# EAGLE design LED_BOARD_1st_Iteration (EAGLE 9.6.2)
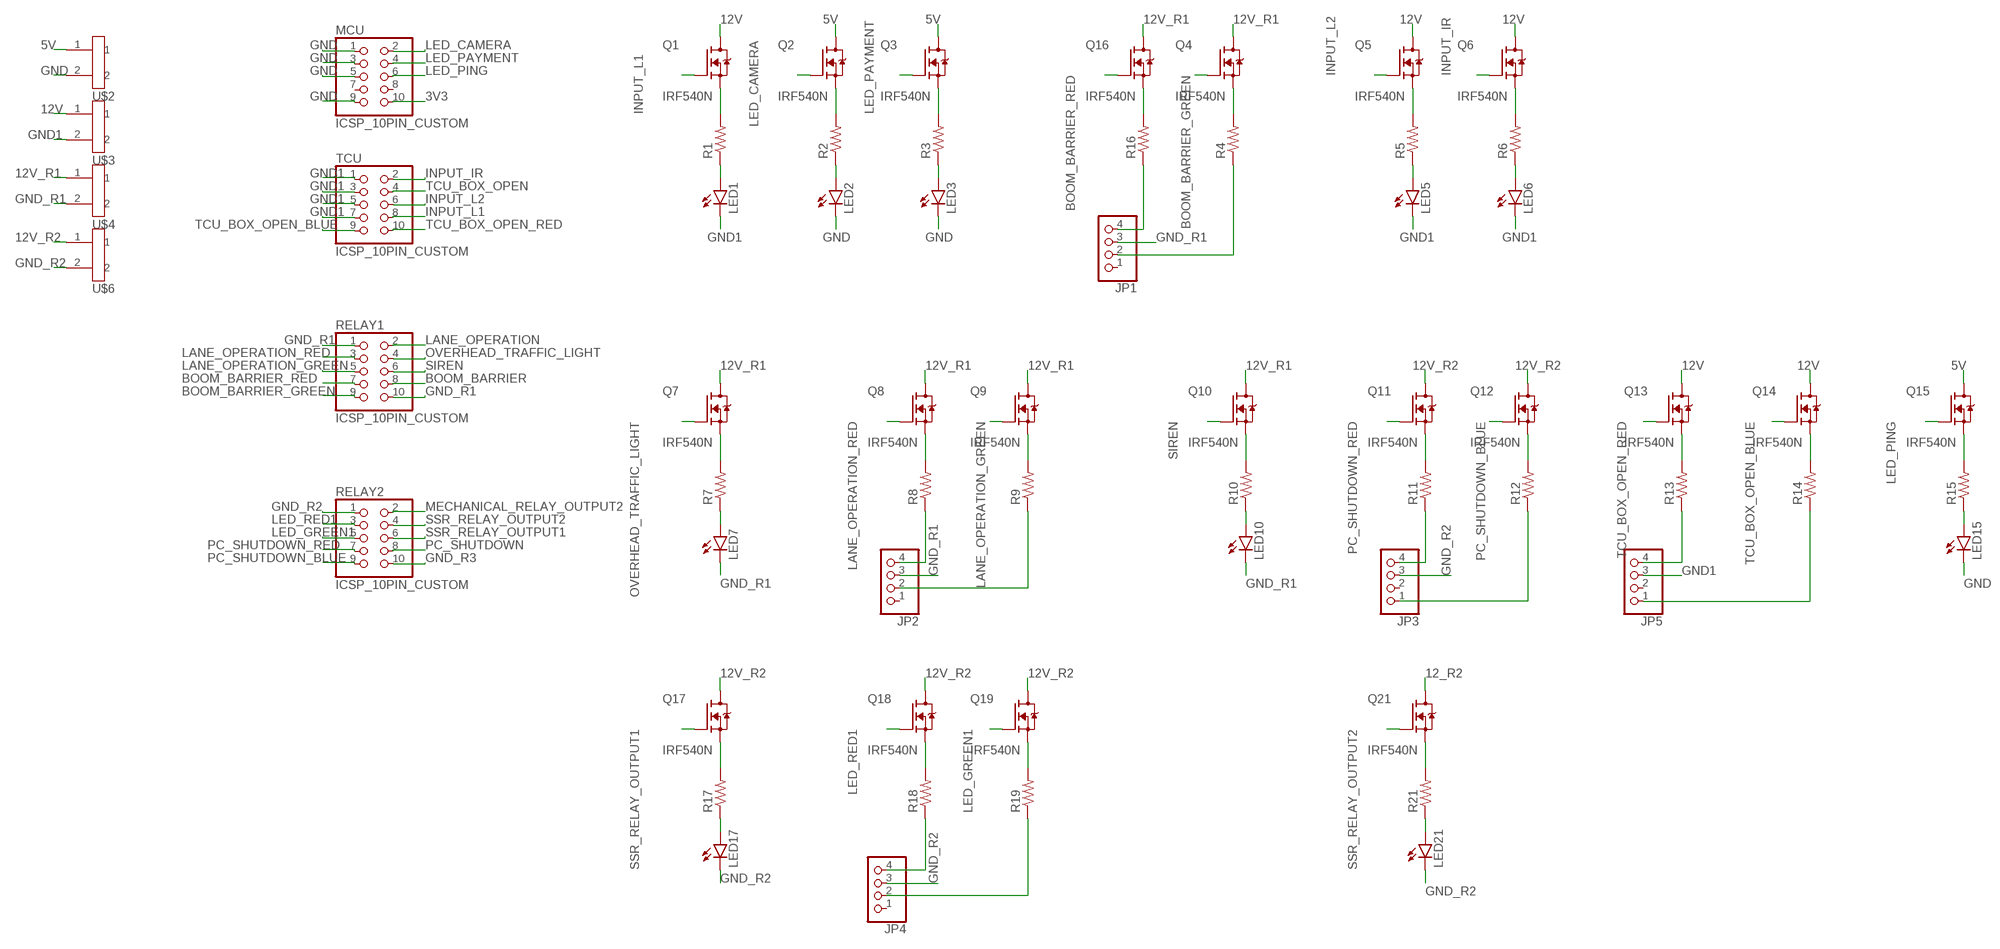
[diagram p0: schematic, sheet 1]

## Parts
JP1  PINHD-1X4  [1X04]
JP2  PINHD-1X4  [1X04]
JP3  PINHD-1X4  [1X04]
JP4  PINHD-1X4  [1X04]
JP5  PINHD-1X4  [1X04]
LED1  LED  [LED]
LED2  LED  [LED]
LED3  LED  [LED]
LED5  LED  [LED]
LED6  LED  [LED]
LED7  LED  [LED]
LED10  LED  [LED]
LED15  LED  [LED]
LED17  LED  [LED]
LED21  LED  [LED]
MCU  ICSP_10PIN_CUSTOM  [ICSP_10PIN_CUSTOM]
Q1  IRF540N  [TO254P1054X469X1930-3]
Q2  IRF540N  [TO254P1054X469X1930-3]
Q3  IRF540N  [TO254P1054X469X1930-3]
Q4  IRF540N  [TO254P1054X469X1930-3]
Q5  IRF540N  [TO254P1054X469X1930-3]
Q6  IRF540N  [TO254P1054X469X1930-3]
Q7  IRF540N  [TO254P1054X469X1930-3]
Q8  IRF540N  [TO254P1054X469X1930-3]
Q9  IRF540N  [TO254P1054X469X1930-3]
Q10  IRF540N  [TO254P1054X469X1930-3]
Q11  IRF540N  [TO254P1054X469X1930-3]
Q12  IRF540N  [TO254P1054X469X1930-3]
Q13  IRF540N  [TO254P1054X469X1930-3]
Q14  IRF540N  [TO254P1054X469X1930-3]
Q15  IRF540N  [TO254P1054X469X1930-3]
Q16  IRF540N  [TO254P1054X469X1930-3]
Q17  IRF540N  [TO254P1054X469X1930-3]
Q18  IRF540N  [TO254P1054X469X1930-3]
Q19  IRF540N  [TO254P1054X469X1930-3]
Q21  IRF540N  [TO254P1054X469X1930-3]
R1  RESISTOR  [RESISTOR]
R2  RESISTOR  [RESISTOR]
R3  RESISTOR  [RESISTOR]
R4  RESISTOR  [RESISTOR]
R5  RESISTOR  [RESISTOR]
R6  RESISTOR  [RESISTOR]
R7  RESISTOR  [RESISTOR]
R8  RESISTOR  [RESISTOR]
R9  RESISTOR  [RESISTOR]
R10  RESISTOR  [RESISTOR]
R11  RESISTOR  [RESISTOR]
R12  RESISTOR  [RESISTOR]
R13  RESISTOR  [RESISTOR]
R14  RESISTOR  [RESISTOR]
R15  RESISTOR  [RESISTOR]
R16  RESISTOR  [RESISTOR]
R17  RESISTOR  [RESISTOR]
R18  RESISTOR  [RESISTOR]
R19  RESISTOR  [RESISTOR]
R21  RESISTOR  [RESISTOR]
RELAY1  ICSP_10PIN_CUSTOM  [ICSP_10PIN_CUSTOM]
RELAY2  ICSP_10PIN_CUSTOM  [ICSP_10PIN_CUSTOM]
TCU  ICSP_10PIN_CUSTOM  [ICSP_10PIN_CUSTOM]
U$2  GREEN_PLUG_90_2  [GREEN_PLUG_90_2]
U$3  GREEN_PLUG_90_2  [GREEN_PLUG_90_2]
U$4  GREEN_PLUG_90_2  [GREEN_PLUG_90_2]
U$6  GREEN_PLUG_90_2  [GREEN_PLUG_90_2]

## Nets
3V3: MCU.10
5V: Q2.2(D) Q3.2(D) Q15.2(D) U$2.1
12_R2: Q21.2(D)
12V: Q1.2(D) Q5.2(D) Q6.2(D) Q13.2(D) Q14.2(D) U$3.1
12V_R1: Q4.2(D) Q7.2(D) Q8.2(D) Q9.2(D) Q10.2(D) Q16.2(D) U$4.1
12V_R2: Q11.2(D) Q12.2(D) Q17.2(D) Q18.2(D) Q19.2(D) U$6.1
BOOM_BARRIER: RELAY1.8
BOOM_BARRIER_GREEN: Q4.1(G) RELAY1.9
BOOM_BARRIER_RED: Q16.1(G) RELAY1.7
GND: LED2.K(C) LED3.K(C) LED15.K(C) MCU.1 MCU.3 MCU.5 MCU.9 U$2.2
GND1: JP5.3 LED1.K(C) LED5.K(C) LED6.K(C) TCU.1 TCU.3 TCU.5 TCU.7 U$3.2
GND_R1: JP1.3 JP2.3 LED7.K(C) LED10.K(C) RELAY1.1 RELAY1.10 U$4.2
GND_R2: JP3.3 JP4.3 LED17.K(C) LED21.K(C) RELAY2.1 U$6.2
GND_R3: RELAY2.10
INPUT_IR: Q6.1(G) TCU.2
INPUT_L1: Q1.1(G) TCU.8
INPUT_L2: Q5.1(G) TCU.6
LANE_OPERATION: RELAY1.2
LANE_OPERATION_GREEN: Q9.1(G) RELAY1.5
LANE_OPERATION_RED: Q8.1(G) RELAY1.3
LED_CAMERA: MCU.2 Q2.1(G)
LED_GREEN1: Q19.1(G) RELAY2.5
LED_PAYMENT: MCU.4 Q3.1(G)
LED_PING: MCU.6 Q15.1(G)
LED_RED1: Q18.1(G) RELAY2.3
MECHANICAL_RELAY_OUTPUT2: RELAY2.2
N$1: Q1.3(S) R1.2
N$2: LED1.A R1.1
N$3: JP1.4 R16.1
N$4: JP1.2 R4.1
N$5: JP2.4 R8.1
N$6: Q2.3(S) R2.2
N$7: LED2.A R2.1
N$8: JP2.2 R9.1
N$9: JP5.4 R13.1
N$10: JP3.4 R11.1
N$11: Q3.3(S) R3.2
N$12: LED3.A R3.1
N$13: JP3.1 R12.1
N$14: JP5.1 R14.1
N$16: Q4.3(S) R4.2
N$21: Q5.3(S) R5.2
N$22: LED5.A R5.1
N$26: Q6.3(S) R6.2
N$27: LED6.A R6.1
N$31: Q7.3(S) R7.2
N$32: LED7.A R7.1
N$36: Q8.3(S) R8.2
N$41: Q9.3(S) R9.2
N$46: Q10.3(S) R10.2
N$47: LED10.A R10.1
N$51: Q11.3(S) R11.2
N$56: Q12.3(S) R12.2
N$61: Q13.3(S) R13.2
N$66: Q14.3(S) R14.2
N$71: Q15.3(S) R15.2
N$72: LED15.A R15.1
N$76: Q16.3(S) R16.2
N$81: Q17.3(S) R17.2
N$82: LED17.A R17.1
N$86: Q18.3(S) R18.2
N$87: JP4.4 R18.1
N$91: Q19.3(S) R19.2
N$92: JP4.2 R19.1
N$101: Q21.3(S) R21.2
N$102: LED21.A R21.1
OVERHEAD_TRAFFIC_LIGHT: Q7.1(G) RELAY1.4
PC_SHUTDOWN: RELAY2.8
PC_SHUTDOWN_BLUE: Q12.1(G) RELAY2.9
PC_SHUTDOWN_RED: Q11.1(G) RELAY2.7
SIREN: Q10.1(G) RELAY1.6
SSR_RELAY_OUTPUT1: Q17.1(G) RELAY2.6
SSR_RELAY_OUTPUT2: Q21.1(G) RELAY2.4
TCU_BOX_OPEN: TCU.4
TCU_BOX_OPEN_BLUE: Q14.1(G) TCU.9
TCU_BOX_OPEN_RED: Q13.1(G) TCU.10
Unconnected: JP1.1 JP2.1 JP3.2 JP4.1 JP5.2 MCU.7 MCU.8

## Library data of the parts
JP1-JP5 = pinhead:PINHD-1X4: PIN HEADER
LED1-LED3 LED5-LED7 LED10 LED15 LED17 LED21 = Hand_Solder:LED: LED HAND SOLDER
MCU RELAY1 RELAY2 TCU = ISCP_10PIN_CUSTOM:ICSP_10PIN_CUSTOM
Q1-Q19 Q21 = IRF540N:IRF540N: Check availability <https://pricing.snapeda.com/parts/IRF540N/Infineon%20Technologies/view-part?ref=eda>; AVAILABILITY: In Stock; CHECK_PRICES: https://www.snapeda.com/parts/IRF540N/Infineon/view-part/?ref=eda; DESCRIPTION: Transistor NPN MOS IRF540/IRF540N INTERNATIONAL RECTIFIER Ampere=28 V=100 TO220; MF: Infineon Technologies; MP: IRF540N; PACKAGE: Package; PRICE: None; SNAPEDA_LINK: https://www.snapeda.com/parts/IRF540N/Infineon/view-part/?ref=snap
R1-R19 R21 = Hand_Solder:RESISTOR: Hand Solder Resistor
U$2-U$4 U$6 = Green_plug_90:GREEN_PLUG_90_2

## Board
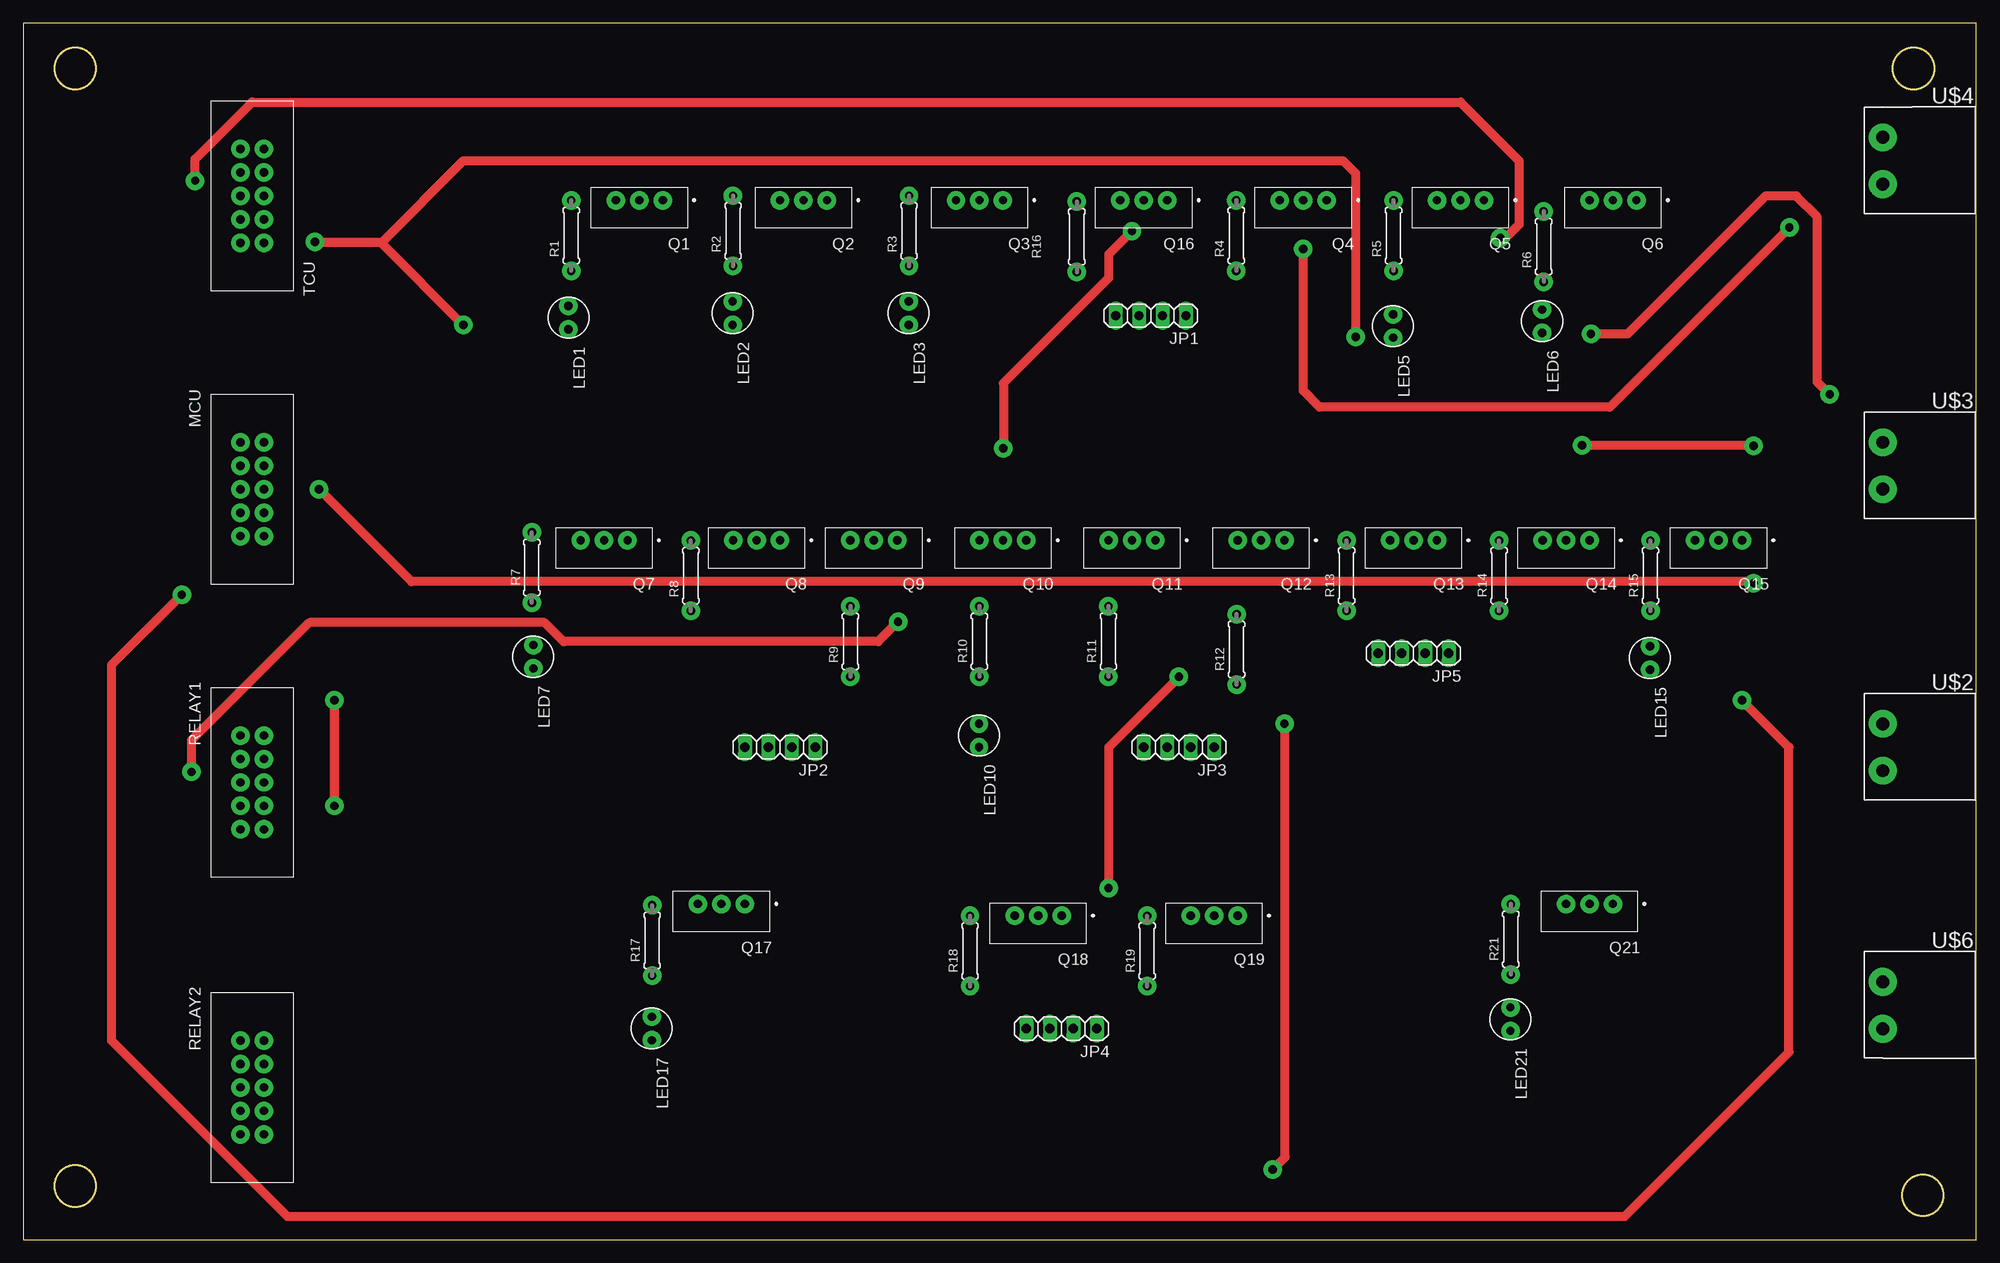
[diagram p1: board, top side]
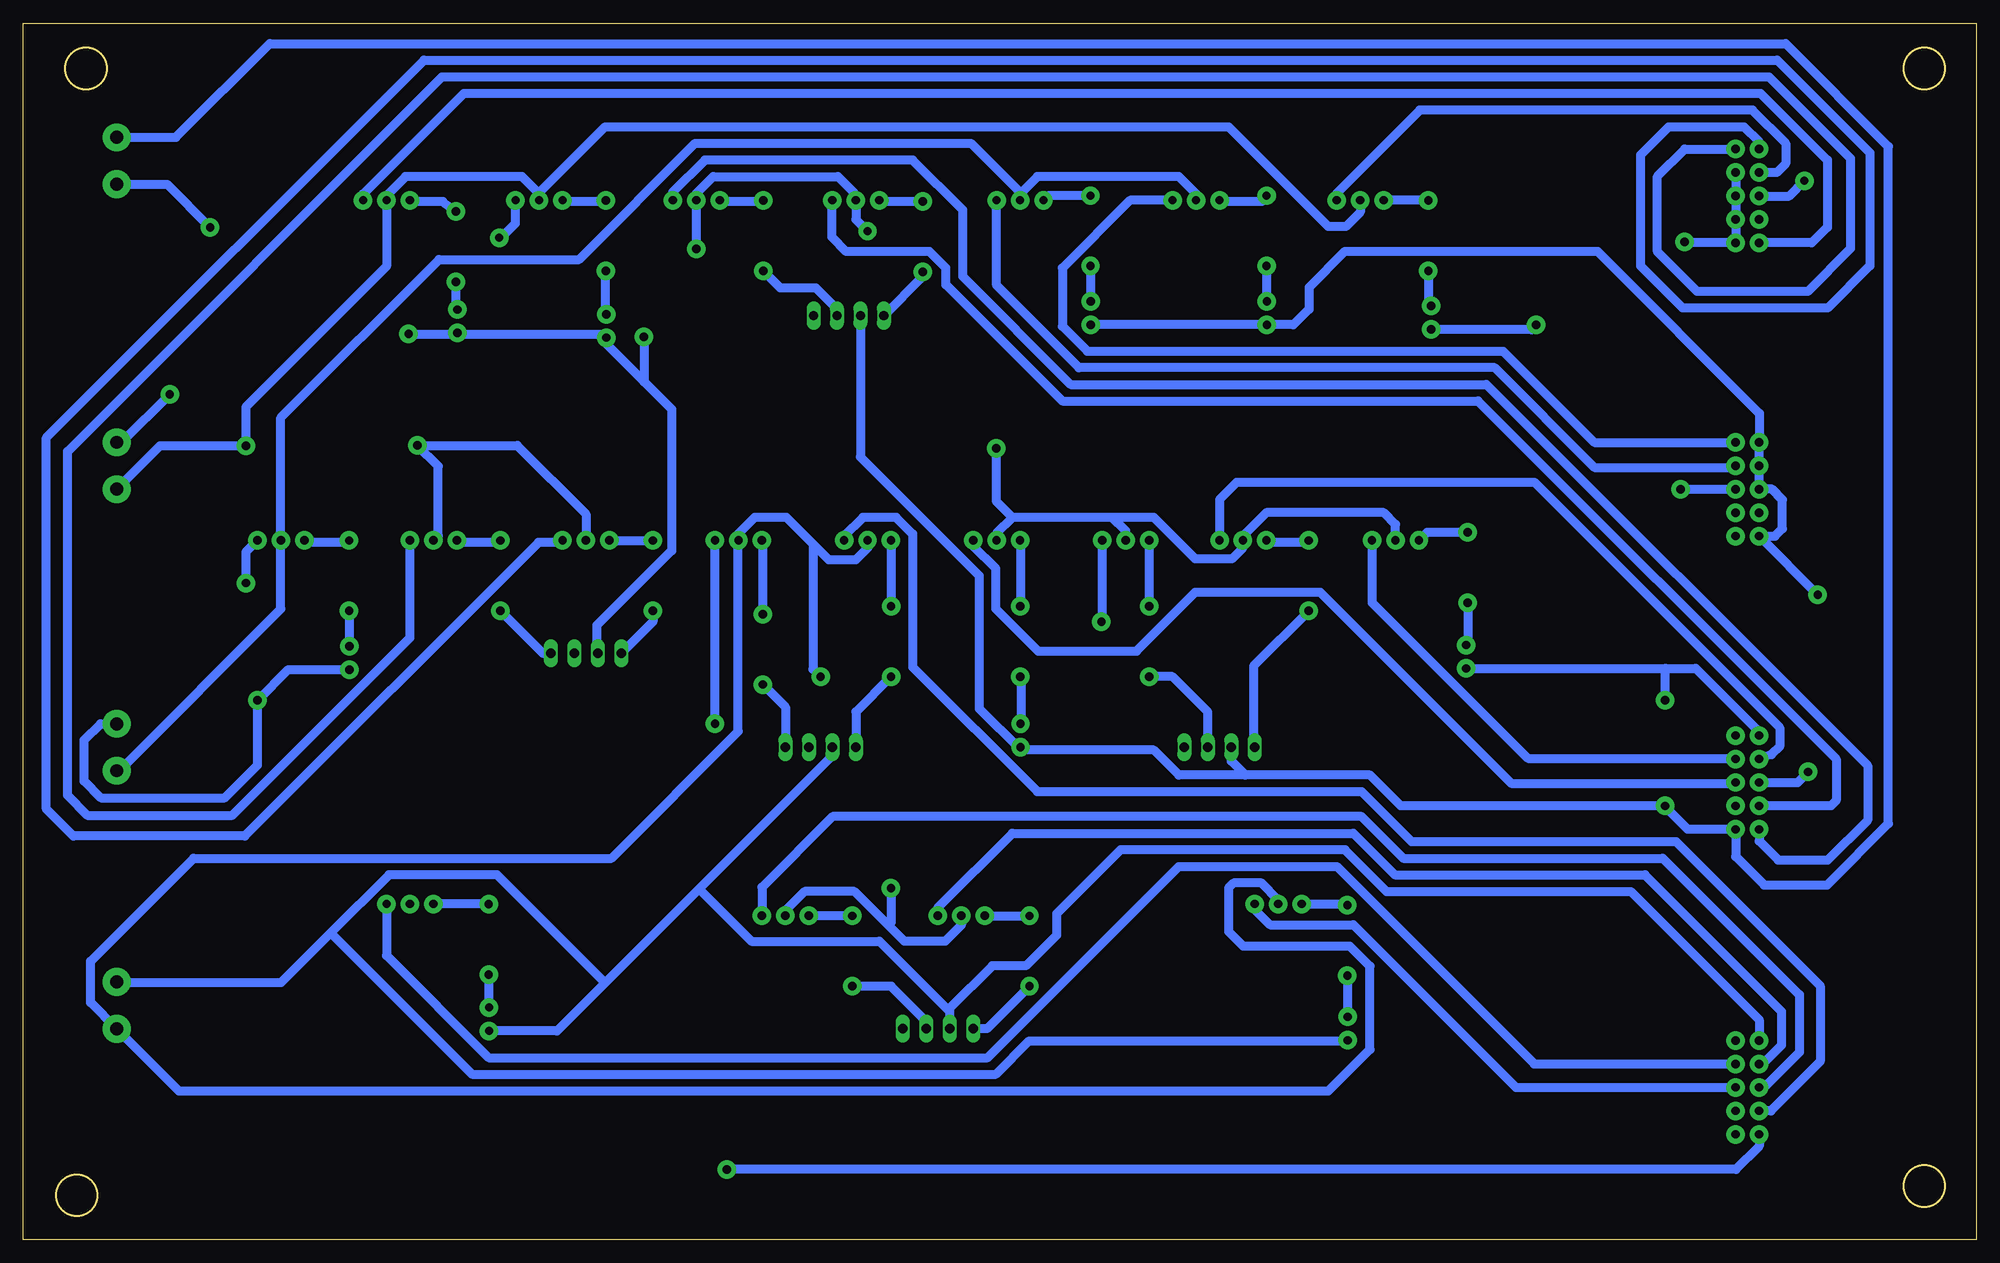
[diagram p2: board, bottom side, seen from below]

Size 211.47 x 131.75 mm. Coordinates in mm from the lower left corner, seen from the top.
Outline: 0,0 211.47,0 211.47,131.75 0,131.75 0,0
Outline: circle at 5.66,126.83 radius 2.24
Outline: circle at 5.66,5.83 radius 2.24
Outline: circle at 204.66,126.83 radius 2.24
Outline: circle at 205.66,4.83 radius 2.24
Copper layers (1*16): Top 0.035mm / dielectric 1.5mm / Bottom 0.035mm
Design rules "default *": minimum track width 1mm, minimum drill 0.35mm, track to track 0.8mm, track to pad 0.5mm, pad to pad 0.5mm, via to via 0.5mm, smd to smd 6mil, copper to edge 40mil, drill to drill 6mil, minimum pad ring 10mil, minimum via ring 8mil, stop-mask expansion 4mil, vias tented up to drill 0mil, thermal gap 10mil

### Footprints (pad centres in the part's own frame; a part is rotated, then mirrored left to right if it is on the bottom)
1X04 = drill 1.016 long: 1 -3.81,0; 2 -1.27,0; 3 1.27,0; 4 3.81,0
LED = drill 0.9 pad 2: A -1.292,-0.049; K 1.248,-0.049
ICSP_10PIN_CUSTOM = drill 0.9 pad 2: 1 -5.08,-1.27; 2 -5.08,1.27; 3 -2.54,-1.27; 4 -2.54,1.27; 5 0,-1.27; 6 0,1.27; 7 2.54,-1.27; 8 2.54,1.27; 9 5.08,-1.27; 10 5.08,1.27
TO254P1054X469X1930-3 = drill 0.9 pad 2: 1 -2.54,-0.81; 2 0,-0.81; 3 2.54,-0.81
RESISTOR = drill 0.9 pad 2: 1 -3.777,0.007; 2 3.843,0.007
GREEN_PLUG_90_2 = drill 1.4 pad 3: 1 0,0; 2 0,-5.08

### Placement (x,y rotation side)
JP1  122.08,100.08 180 top
JP2  81.95,53.34 180 top
JP3  125.13,53.34 180 top
JP4  112.43,22.86 180 top
JP5  150.53,63.5 180 top
LED1  59.09,99.82 270 top
LED2  76.87,100.33 270 top
LED3  95.92,100.33 270 top
LED5  148.37,98.93 270 top
LED6  164.5,99.44 270 top
LED7  55.28,63.12 270 top
LED10  103.54,54.61 270 top
LED15  176.18,62.99 270 top
LED17  68.1,22.86 270 top
LED21  161.07,23.88 270 top
MCU  24.8,81.28 270 top
Q1  66.71,111.76 180 top
Q2  84.49,111.76 180 top
Q3  103.54,111.76 180 top
Q4  138.59,111.76 180 top
Q5  155.61,111.76 180 top
Q6  172.12,111.76 180 top
Q7  62.9,74.93 180 top
Q8  79.41,74.93 180 top
Q9  92.11,74.93 180 top
Q10  106.08,74.93 180 top
Q11  120.05,74.93 180 top
Q12  134.02,74.93 180 top
Q13  150.53,74.93 180 top
Q14  167.04,74.93 180 top
Q15  183.55,74.93 180 top
Q16  121.32,111.76 180 top
Q17  75.6,35.56 180 top
Q18  109.89,34.29 180 top
Q19  128.94,34.29 180 top
Q21  169.58,35.56 180 top
R1  59.34,108.71 90 top
R2  76.87,109.22 90 top
R3  95.92,109.22 90 top
R4  131.35,108.71 90 top
R5  148.37,108.71 90 top
R6  164.62,107.52 90 top
R7  55.07,72.77 90 top
R8  72.3,71.88 90 top
R9  89.57,64.77 90 top
R10  103.54,64.77 90 top
R11  117.51,64.77 90 top
R12  131.38,63.91 90 top
R13  143.29,71.88 90 top
R14  159.8,71.88 90 top
R15  176.18,71.88 90 top
R16  114.08,108.59 90 top
R17  68.1,32.39 90 top
R18  102.52,31.24 90 top
R19  121.7,31.24 90 top
R21  161.07,32.51 90 top
RELAY1  24.8,49.53 270 top
RELAY2  24.8,16.51 270 top
TCU  24.8,113.03 90 top
U$2  201.33,50.8 180 top
U$3  201.33,81.28 180 top
U$4  201.33,114.3 180 top
U$6  201.33,22.86 180 top

### Tracks (layer width: path | path; a pad name or v marks a point on that pad's centre or on a via)
5V
  Bottom 1: 103.46,113.33 101.66,115.13 86.36,115.13 84.49,113.26 Q2.2 | 103.46,113.33 108.86,118.73 138.7,118.73 151.28,106.14 166.45,106.14 183.56,89.03 183.56,76.43 Q15.2 183.56,75.53 183.56,68.33 201.09,50.8 U$2.1 | Q3.2 103.46,112.65 103.46,113.33
12V  (via drill 0.9 pad 2)
  Top 1: v187.36,85.98 168.84,85.98 v168.79,86.03
  Bottom 1: 155.66,113.33 148.46,120.53 80.96,120.53 70.16,109.73 68.27,109.73 66.71,111.29 Q1.2 | 155.66,113.33 155.66,112.43 Q5.2 | 155.66,113.33 157.46,115.13 170.06,115.13 172.12,113.07 Q6.2 172.12,105.41 187.36,90.17 v187.36,85.98 196.63,85.98 U$3.1 | Q14.2 166.53,76.25 166.53,83.77 v168.79,86.03 157.98,86.03 150.53,78.58 Q13.2
12V_R1  (via drill 0.9 pad 2)
  Top 1: v120.05,109.22 117.51,106.68 117.51,104.14 106.13,92.76 v106.13,85.7 | v191.22,109.63 171.76,90.17 140.37,90.17 138.59,91.95 v138.59,107.31
  Bottom 1: 93.56,78.23 104.36,78.23 | 138.56,112.43 138.56,113.33 136.76,115.13 123.26,115.13 121.46,113.33 121.46,112.43 Q16.2 121.32,110.49 v120.05,109.22 | 138.56,112.43 Q4.2 | U$4.1 195.89,114.3 v191.22,109.63 | v138.59,107.31 138.56,107.35 138.56,112.43 | Q7.2 62.9,77.47 64.17,78.74 76.87,78.74 79.41,76.2 Q8.2 79.41,74.93 80.61,73.73 84.56,73.73 89.06,78.23 93.56,78.23 | Q9.2 92.11,76.78 93.56,78.23 | 104.36,78.23 106.08,76.51 Q10.2 | v106.13,85.7 106.13,80 104.36,78.23
12V_R2  (via drill 0.9 pad 2)
  Top 1: v125.13,60.96 117.51,53.34 v117.51,38.1
  Bottom 1: 117.76,34.03 121.46,37.73 126.86,37.73 128.94,35.65 Q19.2 | 117.76,34.03 116.06,32.33 111.65,32.33 109.89,34.09 Q18.2 | 125.96,75.37 128.82,78.23 132.26,78.23 134.06,76.43 134.06,75.53 | 134.06,75.53 134.06,55.05 147.78,41.33 193.02,41.33 204.17,30.18 204.17,25.7 U$6.1 194.6,16.13 70.16,16.13 65.66,20.63 65.66,29.63 67.83,31.8 79.37,31.8 80.96,33.39 80.96,38.1 80.43,38.63 77.4,38.63 75.6,36.83 Q17.2 | 134.06,75.53 Q12.2 | 125.96,75.37 125.96,61.79 v125.13,60.96 | v117.51,38.1 117.51,34.29 117.76,34.03 | Q11.2 120.05,74.93 121.32,73.66 124.25,73.66 125.96,75.37
BOOM_BARRIER_GREEN
  Bottom 1: Q4.1 141.13,113.46 137.66,116.93 115.16,116.93 109.76,111.53 109.76,104.33 98.06,92.63 53.06,92.63 11.79,51.36 11.79,45.44 16.11,41.12 21.47,41.12 23.53,43.18 RELAY1.9
BOOM_BARRIER_RED
  Bottom 1: RELAY1.7 23.5,47.02 15.73,47.02 15.19,47.56 15.19,52.06 53.96,90.83 98.96,90.83 111.56,103.43 111.56,105.23 113.34,107.01 122.35,107.01 123.92,108.58 123.92,112.51 Q16.1
GND  (via drill 0.9 pad 2)
  Top 1: v17.18,69.85 9.56,62.23 9.56,21.59 28.61,2.54 173.39,2.54 191.17,20.32 191.17,53.34 v186.09,58.42
  Bottom 1: U$2.2 203.08,55.88 204.86,54.1 204.86,49.68 203.04,47.87 189.62,47.87 186.09,51.4 v186.09,58.42 182.76,61.74 LED15.K | v17.18,69.85 MCU.9 21.81,76.2 21,77.01 21,80.16 22.12,81.28 MCU.5 MCU.3 MCU.1 23.49,86.4 23.49,89.49 41.03,107.03 68.36,107.03 72.26,103.13 72.26,100.77 73.94,99.08 LED2.K LED3.K
GND1  (via drill 0.9 pad 2)
  Top 1: v31.58,108.05 38.87,108.05 | v47.66,99.06 38.77,107.95 38.87,108.05 | v144.25,97.79 144.25,115.49 142.91,116.84 47.66,116.84 38.87,108.05 | v169.73,98.09 173.69,98.09 188.63,113.03 191.98,113.03 194.23,110.77 194.23,92.89 v195.59,91.54
  Bottom 1: 144.25,92.93 148.46,97.13 LED5.K 148.46,98.03 163.76,98.03 LED6.K 164.55,98.09 v169.73,98.09 | 144.25,92.93 141.26,89.93 141.26,74.63 149.36,66.53 149.36,63.6 JP5.3 | 26.06,110.63 26.06,107.93 TCU.1 26.17,108.05 v31.58,108.05 | TCU.7 26.06,115.13 26.06,113.33 TCU.5 26.06,112.43 26.06,110.63 | 26.06,110.63 TCU.3 | v47.66,99.06 48.17,98.55 59.02,98.55 LED1.K | v144.25,97.79 144.25,92.93 | U$3.2 200.77,86.36 v195.59,91.54
GND_R1  (via drill 0.9 pad 2)
  Top 1: v33.69,58.42 v33.69,46.99
  Bottom 1: 103.46,53.03 107.96,57.53 107.96,71.93 120.81,84.78 JP1.3 | 79.16,50.33 65.66,50.33 62.32,46.99 v33.69,46.99 33.69,46.89 31.25,44.45 RELAY1.10 26.07,41.5 22.99,38.42 16.17,38.42 9.52,45.07 9.52,118.39 20.66,129.53 184.77,129.53 194.92,119.38 U$4.2 | 103.46,53.03 89.06,53.03 86.36,50.33 79.16,50.33 | 103.46,53.03 LED10.K | RELAY1.1 23.53,55 30.4,61.87 33.67,61.87 | JP2.3 80.68,51.85 79.16,50.33 | LED7.K 33.67,61.87 | v33.69,58.42 33.67,58.44 33.67,61.87
GND_R2
  Bottom 1: 148.46,27.83 138.29,37.99 | 178.16,33.23 171.86,39.53 160.16,39.53 148.46,27.83 | 178.16,33.23 183.56,27.83 200.66,27.83 U$6.2 | 178.16,33.23 162.86,17.93 106.16,17.93 102.56,21.53 68.36,21.53 LED17.K | 138.29,37.99 132.63,32.33 118.76,32.33 111.16,24.73 | 148.46,27.83 153.66,22.63 LED21.K | 111.16,24.73 JP4.3 | 111.16,24.73 111.16,25.05 106.54,29.68 102.9,29.68 99.59,32.99 99.59,35.3 92.66,42.23 68.36,42.23 63.86,37.73 37.42,37.73 23.53,23.83 RELAY2.1 | JP3.3 123.86,52.43 138.29,37.99
INPUT_IR
  Bottom 1: TCU.2 17.84,107.95 16.14,109.65 16.14,116.91 23.36,124.13 163.76,124.13 174.66,113.23 Q6.1
INPUT_L1
  Bottom 1: Q1.1 69.26,112.43 69.26,113.33 60.26,122.33 24.26,122.33 20.66,118.73 20.66,116.53 21.62,115.57 TCU.8
INPUT_L2  (via drill 0.9 pad 2)
  Top 1: v18.63,114.68 18.63,117.02 24.8,123.19 155.61,123.19 161.96,116.84 161.96,109.93 160.54,108.51 v159.93,108.51
  Bottom 1: TCU.6 20.28,113.03 v18.63,114.68 | v159.93,108.51 159.72,108.51 158.15,110.08 Q5.1
LANE_OPERATION_GREEN  (via drill 0.9 pad 2)
  Top 1: v94.72,66.93 92.56,64.77 58.53,64.77 56.45,66.84 30.98,66.84 18.21,54.08 v18.21,50.67
  Bottom 1: v94.72,66.93 94.65,67 Q9.1 | v18.21,50.67 19.36,49.53 RELAY1.5
LANE_OPERATION_RED
  Bottom 1: RELAY1.3 22.18,52.55 21.3,53.42 21.3,55.48 47.87,82.04 80.06,82.04 81.95,80.15 Q8.1
LED_CAMERA
  Bottom 1: MCU.2 26.06,86.33 41.36,86.33 51.26,96.23 96.26,96.23 98.96,98.93 98.96,105.23 91.62,112.57 Q2.1
LED_GREEN1
  Bottom 1: RELAY2.5 22.98,16.51 19.17,20.31 19.17,26.53 33.97,41.33 62.06,41.33 66.56,45.83 123.83,45.83 131.48,38.18 Q19.1
LED_PAYMENT
  Bottom 1: MCU.4 26.06,83.63 41.36,83.63 52.16,94.43 97.16,94.43 106.08,103.35 Q3.1
LED_PING  (via drill 0.9 pad 2)
  Top 1: v32.04,81.28 42.04,71.28 187.2,71.28 v187.36,71.12
  Bottom 1: Q15.1 187.36,74.47 v187.36,71.12 | v32.04,81.28 MCU.6
LED_RED1
  Bottom 1: Q18.1 112.46,35.03 112.46,35.93 104.36,44.03 67.46,44.03 62.96,39.53 35.89,39.53 21.1,24.74 21.1,21.09 23.14,19.05 RELAY2.3
N$1
  Bottom 1: R1.2 64.15,112.55 Q1.3
N$2
  Bottom 1: R1.1 59.33,101.41 LED1.A
N$3
  Bottom 1: R16.1 114.07,104.27 JP1.4
N$4
  Bottom 1: R4.1 129.5,103.09 125.65,103.09 123.35,100.79 JP1.2
N$5
  Bottom 1: JP2.4 78.26,53.93 78.26,62.14 R8.1
N$6
  Bottom 1: Q2.3 81.86,112.43 77.36,112.43 R2.2
N$7
  Bottom 1: R2.1 76.86,101.66 LED2.A
N$8
  Bottom 1: JP2.2 83.22,57.15 87.06,60.99 R9.1
N$9
  Bottom 1: R13.1 143.28,66.94 JP5.4
N$10
  Bottom 1: R11.1 121.32,57.18 JP3.4
N$11
  Bottom 1: R3.2 100.51,113.06 Q3.3
N$12
  Bottom 1: LED3.A 95.87,105.4 R3.1
N$13
  Bottom 1: R12.1 128.94,57.7 JP3.1
N$14
  Bottom 1: R14.1 155.19,63.5 JP5.1
N$16
  Bottom 1: Q4.3 135.86,112.43 131.36,112.43 R4.2
N$21
  Bottom 1: Q5.3 152.96,112.43 148.46,112.43 R5.2
N$22
  Bottom 1: LED5.A 148.46,100.73 148.46,104.33 R5.1
N$26
  Bottom 1: Q6.3 169.16,112.43 166.05,112.43 R6.2
N$27
  Bottom 1: LED6.A 164.66,100.73 164.66,103.6 R6.1
N$31
  Bottom 1: R7.2 59.48,76.61 Q7.3
N$32
  Bottom 1: R7.1 55.07,64.57 LED7.A
N$36
  Bottom 1: Q8.3 76.46,75.53 72.86,75.53 R8.2
N$41
  Bottom 1: Q9.3 R9.2
N$46
  Bottom 1: Q10.3 103.46,75.53 103.46,69.23 R10.2
N$47
  Bottom 1: LED10.A 103.46,56.63 103.46,60.23 R10.1
N$51
  Bottom 1: Q11.3 R11.2
N$56
  Bottom 1: Q12.3 131.36,75.53 131.36,67.81 R12.2
N$61
  Bottom 1: Q13.3 143.3,75.74 R13.2
N$66
  Bottom 1: Q14.3 163.76,75.53 160.16,75.53 R14.2
N$71
  Bottom 1: Q15.3 180.86,75.53 176.36,75.53 R15.2
N$72
  Bottom 1: R15.1 176.17,64.33 LED15.A
N$76
  Bottom 1: Q16.3 118.76,112.43 114.26,112.43 R16.2
N$81
  Bottom 1: Q17.3 68.24,36.37 R17.2
N$82
  Bottom 1: R17.1 68.1,24.19 LED17.A
N$86
  Bottom 1: Q18.3 107.06,35.03 102.56,35.03 R18.2
N$87
  Bottom 1: R18.1 107.12,22.86 JP4.4
N$91
  Bottom 1: R19.2 126.38,35.08 Q19.3
N$92
  Bottom 1: R19.1 117.49,27.46 113.7,23.67 JP4.2
N$101
  Bottom 1: R21.2 167.02,36.35 Q21.3
N$102
  Bottom 1: R21.1 161.06,25.21 LED21.A
OVERHEAD_TRAFFIC_LIGHT
  Bottom 1: RELAY1.4 26.06,52.13 48.56,52.13 65.44,69.01 Q7.1
PC_SHUTDOWN_BLUE  (via drill 0.9 pad 2)
  Top 1: v135.29,7.62 136.63,8.97 136.63,55.8 v136.56,55.88
  Bottom 1: RELAY2.9 23.53,10.13 26.04,7.62 v135.29,7.62 | v136.56,55.88 Q12.1
PC_SHUTDOWN_RED
  Bottom 1: RELAY2.7 22.26,13.97 16.92,19.31 16.92,27.51 32.54,43.13 61.16,43.13 66.56,48.53 101.66,48.53 115.16,62.03 115.16,76.43 116.96,78.23 120.56,78.23 122.59,76.2 Q11.1
SIREN
  Bottom 1: Q10.1 108.62,75.14 106.16,72.68 106.16,68.33 101.59,63.76 90.93,63.76 84.56,70.13 71.06,70.13 50.36,49.43 26.17,49.43 RELAY1.6
SSR_RELAY_OUTPUT1
  Bottom 1: Q17.1 78.14,35.81 76.46,34.13 67.46,34.13 49.84,16.51 RELAY2.6
SSR_RELAY_OUTPUT2
  Bottom 1: Q21.1 172.12,30.79 161.06,19.73 107.06,19.73 86.36,40.43 69.26,40.43 47.88,19.05 RELAY2.4
TCU_BOX_OPEN_BLUE
  Bottom 1: TCU.9 31.58,118.11 34.52,115.17 34.52,106.99 30.22,102.69 18.28,102.69 13.63,107.34 13.63,117.1 22.46,125.93 166.11,125.93 206.66,85.38 206.66,48.12 204.5,45.97 188.82,45.97 169.58,65.21 Q14.1
TCU_BOX_OPEN_RED
  Bottom 1: Q13.1 152.96,75.53 155.66,75.53 187.45,43.74 206.04,43.74 208.94,46.64 208.94,86.86 168.07,127.73 21.56,127.73 11.52,117.7 11.52,105.47 16.11,100.89 31.78,100.89 36.35,105.45 36.35,117.49 33.31,120.53 25.16,120.53 23.53,118.9 TCU.10

### Text on the board
tDocu: MADE IN BANGLADESH